# Altium schematic sheet PowerSupply.SchDoc
size A
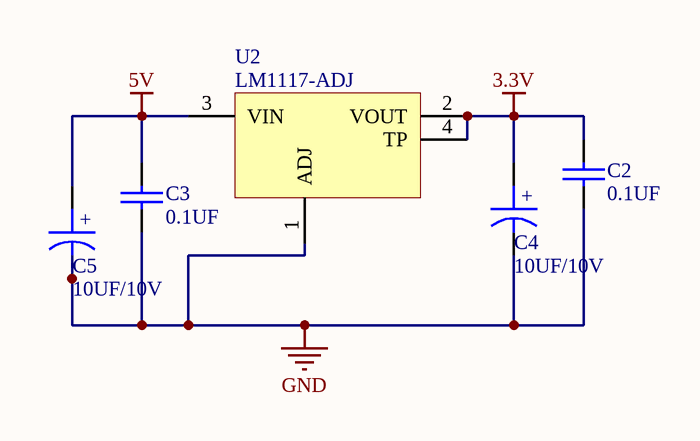
[diagram p0: PowerSupply.SchDoc]

## Parts
C2  0.1UF  [CAPC0603]
C3  0.1UF  [CAPC0603]
C4  10UF/10V  [CAPC1206_TANTALUM]
C5  10UF/10V  [CAPC1206_TANTALUM]
U2  LM1117-ADJ  [SOT223]

## Nets
3.3V: C2.1 C4.1 U2.2(VOUT) U2.4(TP)
5V: C3.1 C5.1 U2.3(VIN)
GND: C2.2 C3.2 C4.2 C5.2 U2.1(ADJ)

## Notes on the sheet
- (in symbol CAP) +

## Library data of the parts
C2 C3 = CAP NP
C4 C5 = CAP
U2 = LM1117-3.3V_ADJ: 3.3V LDO REGULATOR